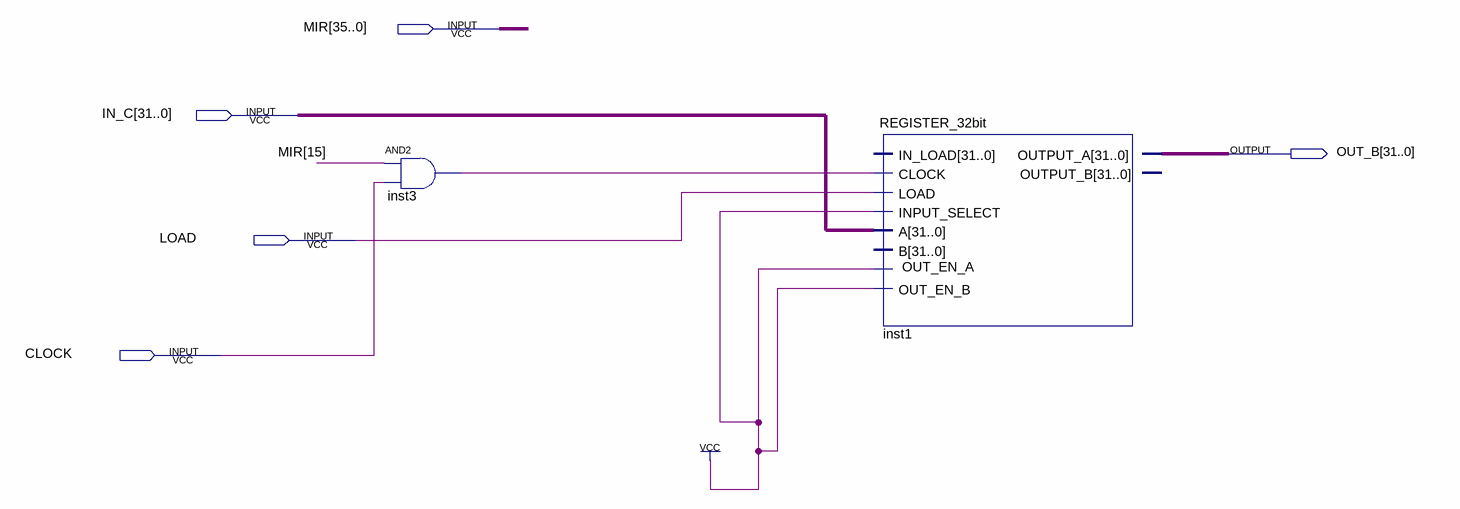
[diagram p0: schematic sheet]
// Quartus schematic H.bdf as structural Verilog: 2 symbols, 5 pins
module H (
  input  [35:0] MIR,
  input  [31:0] IN_C,
  input  LOAD,
  input  CLOCK,
  output [31:0] OUT_B
);

  wire inst3_out;

  and inst3 (inst3_out, MIR[15], CLOCK);
  REGISTER_32bit inst1 (
    .LOAD(LOAD), .OUT_EN_A(1'b1), .CLOCK(inst3_out), .OUT_EN_B(1'b1), .INPUT_SELECT(1'b1), .A(IN_C),
    .OUTPUT_A(OUT_B));  // open: IN_LOAD, B, OUTPUT_B
endmodule
